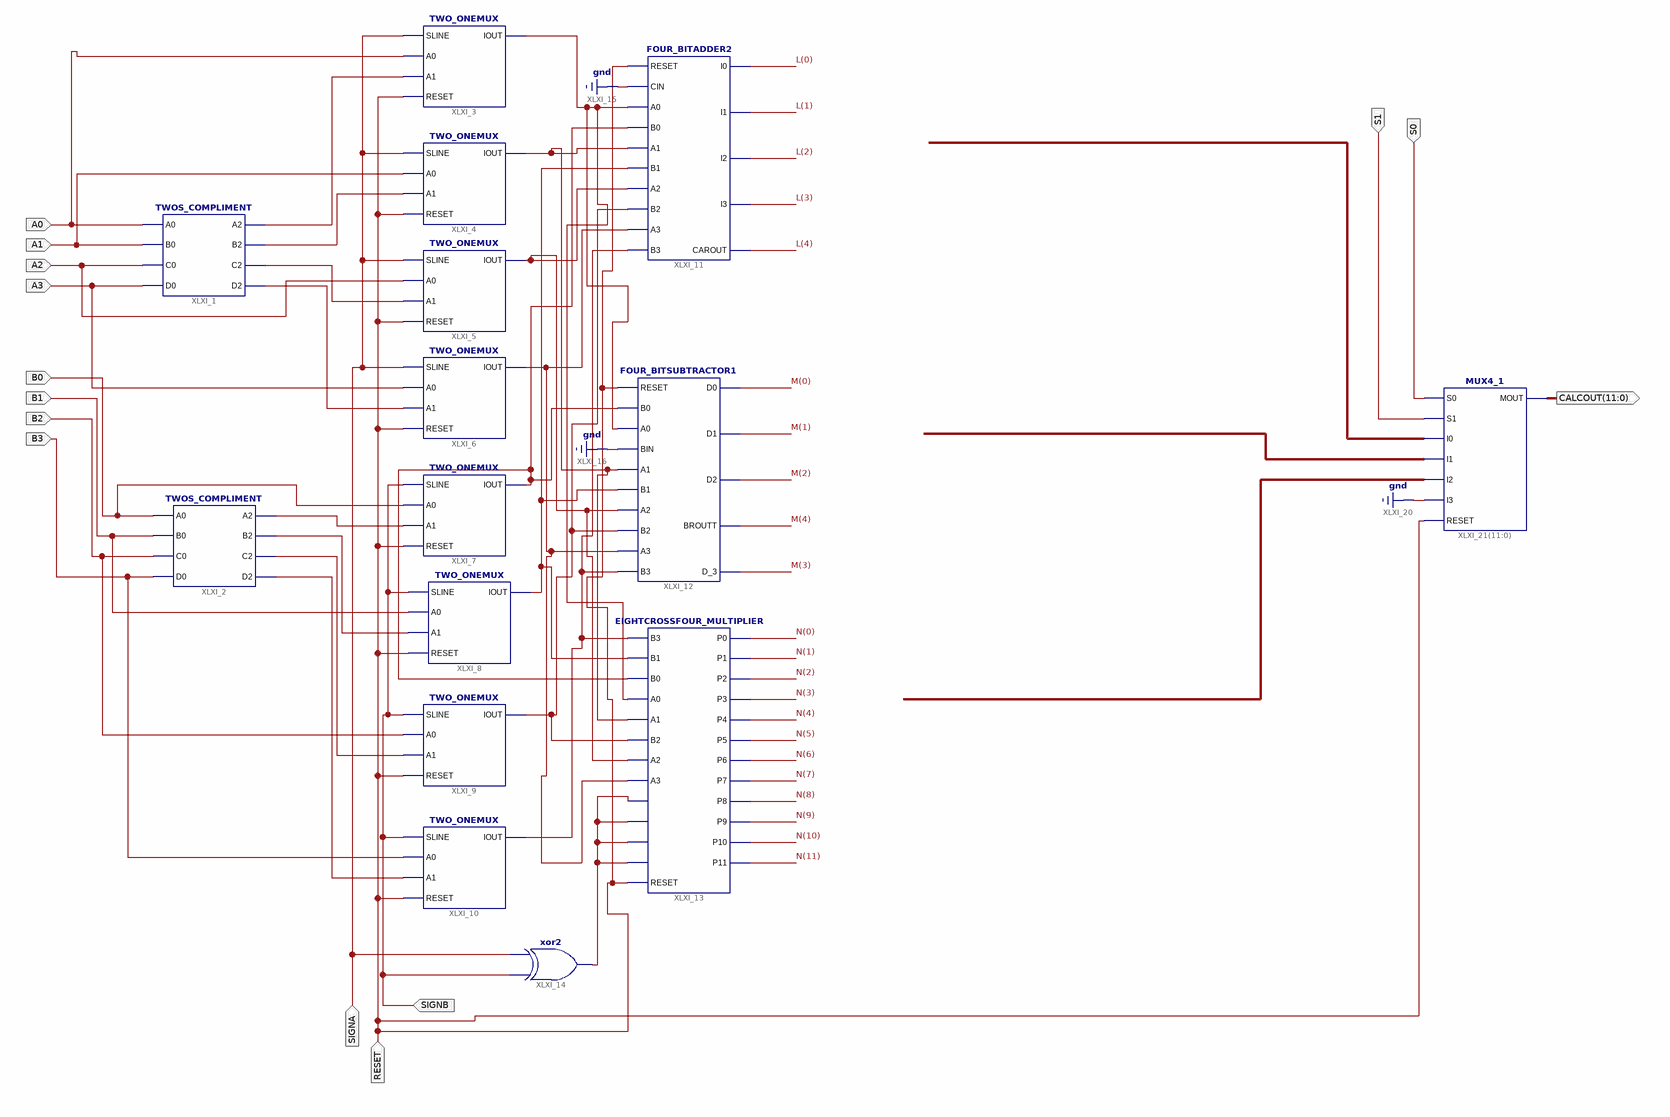
[diagram p0: schematic sheet 1]
// Xilinx ISE schematic CALCULATOR2.sch (artix7) as structural Verilog: 15 symbols, 14 ports
module CALCULATOR2 (
  input  A0,
  input  A1,
  input  A2,
  input  A3,
  input  B0,
  input  B1,
  input  B2,
  input  B3,
  input  SIGNB,
  input  SIGNA,
  input  RESET,
  input  S0,
  input  S1,
  output [11:0] CALCOUT
);

  wire XLXN_12, XLXN_13, XLXN_14, XLXN_16, XLXN_22, XLXN_23, XLXN_24, XLXN_25, XLXN_42, XLXN_46, XLXN_53,
       XLXN_60, XLXN_63, XLXN_77, XLXN_78, XLXN_102, XLXN_104;
  wire [11:0] L, M, N;

  TWOS_COMPLIMENT XLXI_1 (.A0(A0), .B0(A1), .C0(A2), .D0(A3), .A2(XLXN_12), .B2(XLXN_13), .C2(XLXN_14), .D2(XLXN_16));
  TWOS_COMPLIMENT XLXI_2 (.A0(B0), .B0(B1), .C0(B2), .D0(B3), .A2(XLXN_22), .B2(XLXN_23), .C2(XLXN_24), .D2(XLXN_25));
  TWO_ONEMUX XLXI_3 (.SLINE(SIGNA), .A0(A0), .A1(XLXN_12), .RESET(RESET), .IOUT(XLXN_77));
  TWO_ONEMUX XLXI_4 (.SLINE(SIGNA), .A0(A1), .A1(XLXN_13), .RESET(RESET), .IOUT(XLXN_104));
  TWO_ONEMUX XLXI_5 (.SLINE(SIGNA), .A0(A2), .A1(XLXN_14), .RESET(RESET), .IOUT(XLXN_60));
  TWO_ONEMUX XLXI_6 (.SLINE(SIGNA), .A0(A3), .A1(XLXN_16), .RESET(RESET), .IOUT(XLXN_63));
  TWO_ONEMUX XLXI_7 (.SLINE(SIGNB), .A0(B0), .A1(XLXN_22), .RESET(RESET), .IOUT(XLXN_42));
  TWO_ONEMUX XLXI_8 (.SLINE(SIGNB), .A0(B1), .A1(XLXN_23), .RESET(RESET), .IOUT(XLXN_46));
  TWO_ONEMUX XLXI_9 (.SLINE(SIGNB), .A0(B2), .A1(XLXN_24), .RESET(RESET), .IOUT(XLXN_53));
  TWO_ONEMUX XLXI_10 (.SLINE(SIGNB), .A0(B3), .A1(XLXN_25), .RESET(RESET), .IOUT(XLXN_78));
  FOUR_BITADDER2 XLXI_11 (
    .RESET(RESET), .CIN(1'b0), .A0(XLXN_77), .B0(XLXN_42), .A1(XLXN_104), .B1(XLXN_46), .A2(XLXN_60),
    .B2(XLXN_53), .A3(XLXN_63), .B3(XLXN_78), .I0(L[0]), .I1(L[1]), .I2(L[2]), .I3(L[3]), .CAROUT(L[4]));
  FOUR_BITSUBTRACTOR1 XLXI_12 (
    .RESET(RESET), .B0(XLXN_42), .A0(XLXN_77), .BIN(1'b0), .A1(XLXN_104), .B1(XLXN_46), .A2(XLXN_60),
    .B2(XLXN_53), .A3(XLXN_63), .B3(XLXN_78), .D0(M[0]), .D1(M[1]), .D2(M[2]), .BROUTT(M[4]), .D_3(M[3]));
  EIGHTCROSSFOUR_MULTIPLIER XLXI_13 (
    .B3(XLXN_78), .B1(XLXN_46), .B0(XLXN_42), .A0(XLXN_77), .A1(XLXN_104), .B2(XLXN_53), .A2(XLXN_60),
    .A3(XLXN_63), .A4(XLXN_102), .A5(XLXN_102), .A6(XLXN_102), .A7(XLXN_102), .RESET(RESET), .P0(N[0]),
    .P1(N[1]), .P2(N[2]), .P3(N[3]), .P4(N[4]), .P5(N[5]), .P6(N[6]), .P7(N[7]), .P8(N[8]), .P9(N[9]),
    .P10(N[10]), .P11(N[11]));
  xor XLXI_14 (XLXN_102, SIGNB, SIGNA);
  MUX4_1 XLXI_21[11:0] (.S0(S0), .S1(S1), .I0(L), .I1(M), .I2(N), .I3(1'b0), .RESET(RESET), .MOUT(CALCOUT));
endmodule
